# Altium schematic sheet E17-PDU-MASTER.SchDoc
size B
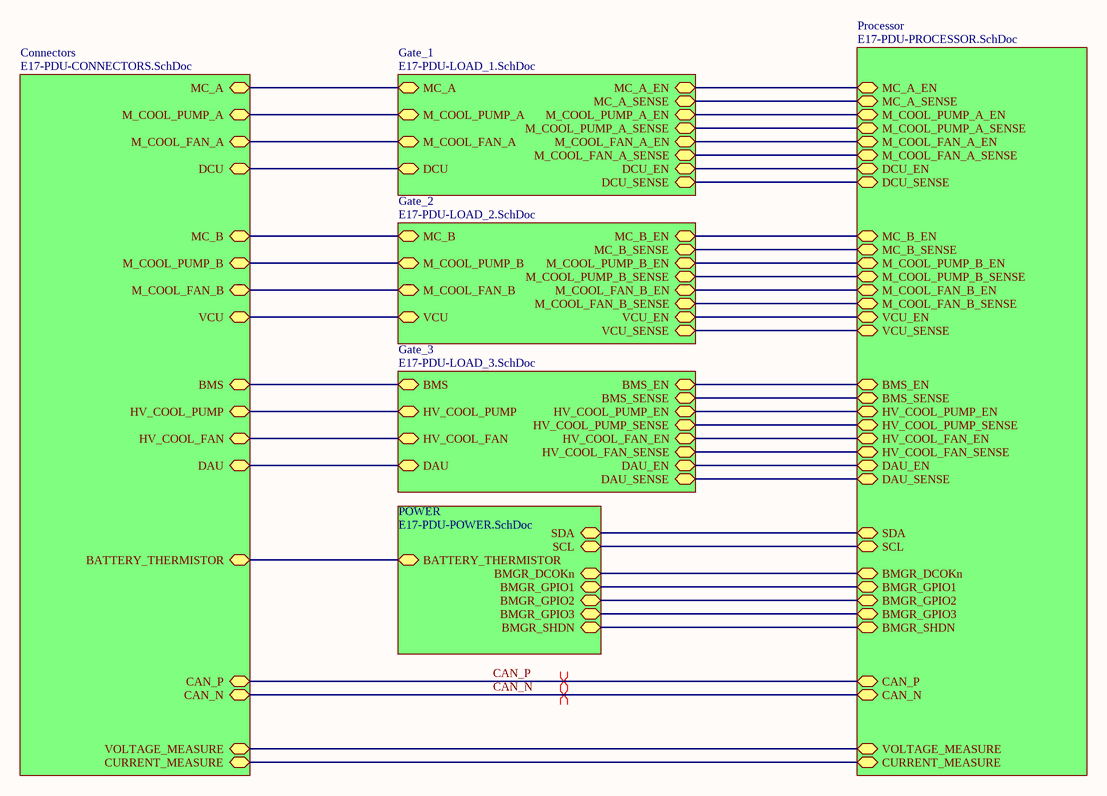
[diagram p0: E17-PDU-MASTER.SchDoc]

## Sub-sheets
Connectors = E17-PDU-CONNECTORS.SchDoc: MC_A, M_COOL_PUMP_A, M_COOL_FAN_A, MC_B, M_COOL_PUMP_B, DCU, VCU, BMS, CAN_P, CAN_N, VOLTAGE_MEASURE, CURRENT_MEASURE, HV_COOL_PUMP, HV_COOL_FAN, M_COOL_FAN_B, DAU, BATTERY_THERMISTOR
Gate_1 = E17-PDU-LOAD_1.SchDoc: MC_A, M_COOL_PUMP_A, M_COOL_FAN_A, MC_A_EN, M_COOL_PUMP_A_EN, M_COOL_FAN_A_EN, MC_A_SENSE, M_COOL_PUMP_A_SENSE, M_COOL_FAN_A_SENSE, DCU, DCU_EN, DCU_SENSE
Gate_2 = E17-PDU-LOAD_2.SchDoc: MC_B, M_COOL_PUMP_B, MC_B_EN, M_COOL_PUMP_B_EN, MC_B_SENSE, M_COOL_PUMP_B_SENSE, VCU, VCU_EN, VCU_SENSE, M_COOL_FAN_B, M_COOL_FAN_B_EN, M_COOL_FAN_B_SENSE
Gate_3 = E17-PDU-LOAD_3.SchDoc: BMS, BMS_EN, BMS_SENSE, HV_COOL_PUMP_SENSE, HV_COOL_PUMP_EN, HV_COOL_FAN_SENSE, HV_COOL_FAN_EN, HV_COOL_PUMP, HV_COOL_FAN, DAU_EN, DAU, DAU_SENSE
POWER = E17-PDU-POWER.SchDoc: BATTERY_THERMISTOR, BMGR_DCOKn, BMGR_GPIO1, BMGR_GPIO2, BMGR_GPIO3, BMGR_SHDN, SDA, SCL
Processor = E17-PDU-PROCESSOR.SchDoc: MC_A_EN, M_COOL_PUMP_A_EN, M_COOL_FAN_A_EN, M_COOL_FAN_B_EN, MC_B_EN, M_COOL_PUMP_B_EN, DCU_EN, VCU_EN, BMS_EN, VOLTAGE_MEASURE, CURRENT_MEASURE, CAN_P, CAN_N, MC_A_SENSE, M_COOL_PUMP_A_SENSE, M_COOL_FAN_A_SENSE, M_COOL_FAN_B_SENSE, MC_B_SENSE, M_COOL_PUMP_B_SENSE, DCU_SENSE, VCU_SENSE, BMS_SENSE, HV_COOL_PUMP_SENSE, HV_COOL_PUMP_EN, HV_COOL_FAN_SENSE, HV_COOL_FAN_EN, DAU_EN, DAU_SENSE, BMGR_DCOKn, BMGR_GPIO1, BMGR_GPIO2, BMGR_GPIO3, BMGR_SHDN, SCL, SDA

## Nets
CAN_N: sheet Connectors/CAN_N, sheet Processor/CAN_N
CAN_P: sheet Connectors/CAN_P, sheet Processor/CAN_P
(unnamed): sheet Connectors/MC_A, sheet Gate_1/MC_A
(unnamed): sheet Connectors/M_COOL_PUMP_A, sheet Gate_1/M_COOL_PUMP_A
(unnamed): sheet Connectors/M_COOL_FAN_A, sheet Gate_1/M_COOL_FAN_A
(unnamed): sheet Connectors/MC_B, sheet Gate_2/MC_B
(unnamed): sheet Connectors/M_COOL_PUMP_B, sheet Gate_2/M_COOL_PUMP_B
(unnamed): sheet Connectors/DCU, sheet Gate_1/DCU
(unnamed): sheet Connectors/VCU, sheet Gate_2/VCU
(unnamed): sheet Connectors/BMS, sheet Gate_3/BMS
(unnamed): sheet Connectors/VOLTAGE_MEASURE, sheet Processor/VOLTAGE_MEASURE
(unnamed): sheet Connectors/CURRENT_MEASURE, sheet Processor/CURRENT_MEASURE
(unnamed): sheet Connectors/HV_COOL_PUMP, sheet Gate_3/HV_COOL_PUMP
(unnamed): sheet Connectors/HV_COOL_FAN, sheet Gate_3/HV_COOL_FAN
(unnamed): sheet Connectors/M_COOL_FAN_B, sheet Gate_2/M_COOL_FAN_B
(unnamed): sheet Connectors/DAU, sheet Gate_3/DAU
(unnamed): sheet Connectors/BATTERY_THERMISTOR, sheet POWER/BATTERY_THERMISTOR
(unnamed): sheet Processor/MC_A_EN, sheet Gate_1/MC_A_EN
(unnamed): sheet Processor/M_COOL_PUMP_A_EN, sheet Gate_1/M_COOL_PUMP_A_EN
(unnamed): sheet Processor/M_COOL_FAN_A_EN, sheet Gate_1/M_COOL_FAN_A_EN
(unnamed): sheet Processor/M_COOL_FAN_B_EN, sheet Gate_2/M_COOL_FAN_B_EN
(unnamed): sheet Processor/MC_B_EN, sheet Gate_2/MC_B_EN
(unnamed): sheet Processor/M_COOL_PUMP_B_EN, sheet Gate_2/M_COOL_PUMP_B_EN
(unnamed): sheet Processor/DCU_EN, sheet Gate_1/DCU_EN
(unnamed): sheet Processor/VCU_EN, sheet Gate_2/VCU_EN
(unnamed): sheet Processor/BMS_EN, sheet Gate_3/BMS_EN
(unnamed): sheet Processor/MC_A_SENSE, sheet Gate_1/MC_A_SENSE
(unnamed): sheet Processor/M_COOL_PUMP_A_SENSE, sheet Gate_1/M_COOL_PUMP_A_SENSE
(unnamed): sheet Processor/M_COOL_FAN_A_SENSE, sheet Gate_1/M_COOL_FAN_A_SENSE
(unnamed): sheet Processor/M_COOL_FAN_B_SENSE, sheet Gate_2/M_COOL_FAN_B_SENSE
(unnamed): sheet Processor/MC_B_SENSE, sheet Gate_2/MC_B_SENSE
(unnamed): sheet Processor/M_COOL_PUMP_B_SENSE, sheet Gate_2/M_COOL_PUMP_B_SENSE
(unnamed): sheet Processor/DCU_SENSE, sheet Gate_1/DCU_SENSE
(unnamed): sheet Processor/VCU_SENSE, sheet Gate_2/VCU_SENSE
(unnamed): sheet Processor/BMS_SENSE, sheet Gate_3/BMS_SENSE
(unnamed): sheet Processor/HV_COOL_PUMP_SENSE, sheet Gate_3/HV_COOL_PUMP_SENSE
(unnamed): sheet Processor/HV_COOL_PUMP_EN, sheet Gate_3/HV_COOL_PUMP_EN
(unnamed): sheet Processor/HV_COOL_FAN_SENSE, sheet Gate_3/HV_COOL_FAN_SENSE
(unnamed): sheet Processor/HV_COOL_FAN_EN, sheet Gate_3/HV_COOL_FAN_EN
(unnamed): sheet Processor/DAU_EN, sheet Gate_3/DAU_EN
(unnamed): sheet Processor/DAU_SENSE, sheet Gate_3/DAU_SENSE
(unnamed): sheet Processor/BMGR_DCOKn, sheet POWER/BMGR_DCOKn
(unnamed): sheet Processor/BMGR_GPIO1, sheet POWER/BMGR_GPIO1
(unnamed): sheet Processor/BMGR_GPIO2, sheet POWER/BMGR_GPIO2
(unnamed): sheet Processor/BMGR_GPIO3, sheet POWER/BMGR_GPIO3
(unnamed): sheet Processor/BMGR_SHDN, sheet POWER/BMGR_SHDN
(unnamed): sheet Processor/SCL, sheet POWER/SCL
(unnamed): sheet Processor/SDA, sheet POWER/SDA

## Layout directives
differential pair: CAN_N, CAN_P